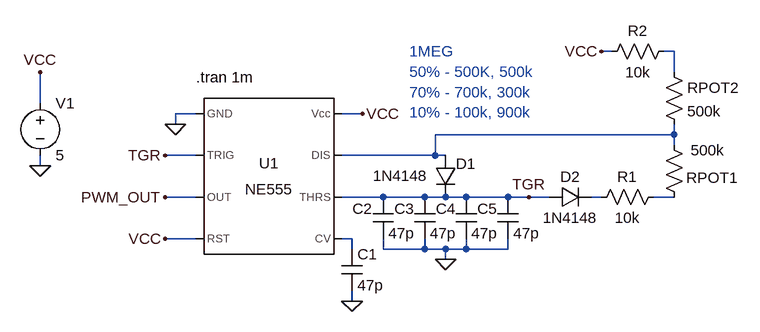
[diagram p0: schematic PWM-gen.asc]
PWM-gen.asc, the LTspice schematic file:
Version 4
SHEET 1 1152 680
WIRE 752 -32 736 -32
WIRE 848 -32 832 -32
WIRE 848 0 848 -32
WIRE -128 48 -128 0
WIRE 112 64 80 64
WIRE 368 64 336 64
WIRE 80 80 80 64
WIRE 848 96 848 80
WIRE 848 96 480 96
WIRE 848 112 848 96
WIRE 112 128 64 128
WIRE 480 128 480 96
WIRE 480 128 336 128
WIRE 496 128 480 128
WIRE -128 144 -128 128
WIRE 112 192 64 192
WIRE 400 192 336 192
WIRE 464 192 400 192
WIRE 496 192 464 192
WIRE 528 192 496 192
WIRE 592 192 528 192
WIRE 624 192 592 192
WIRE 656 192 624 192
WIRE 736 192 720 192
WIRE 848 192 816 192
WIRE 112 256 64 256
WIRE 352 256 336 256
WIRE 352 272 352 256
WIRE 400 272 400 256
WIRE 464 272 464 256
WIRE 464 272 400 272
WIRE 496 272 464 272
WIRE 528 272 528 256
WIRE 528 272 496 272
WIRE 592 272 592 256
WIRE 592 272 528 272
WIRE 496 288 496 272
WIRE 352 352 352 336
FLAG -128 144 0
FLAG -128 0 VCC
FLAG 368 64 VCC
FLAG 64 256 VCC
FLAG 80 80 0
FLAG 64 192 PWM_OUT
FLAG 624 192 TGR
FLAG 64 128 TGR
FLAG 352 352 0
FLAG 736 -32 VCC
FLAG 496 288 0
SYMBOL Misc\\NE555 224 160 R0
SYMATTR InstName U1
SYMBOL voltage -128 32 R0
WINDOW 123 0 0 Left 0
WINDOW 39 0 0 Left 0
SYMATTR InstName V1
SYMATTR Value 5
SYMBOL diode 480 128 R0
WINDOW 0 32 13 Left 2
WINDOW 3 -96 31 Left 2
SYMATTR InstName D1
SYMATTR Value 1N4148
SYMBOL cap 336 272 R0
SYMATTR InstName C1
SYMATTR Value 47p
SYMBOL cap 384 192 R0
WINDOW 0 -31 18 Left 2
SYMATTR InstName C2
SYMATTR Value 47p
SYMBOL res 720 208 R270
WINDOW 0 32 56 VTop 2
WINDOW 3 0 56 VBottom 2
SYMATTR InstName R1
SYMATTR Value 10k
SYMBOL diode 656 208 R270
WINDOW 0 32 32 VTop 2
WINDOW 3 0 32 VBottom 2
SYMATTR InstName D2
SYMATTR Value 1N4148
SYMBOL res 848 -48 R90
WINDOW 0 0 56 VBottom 2
WINDOW 3 32 56 VTop 2
SYMATTR InstName R2
SYMATTR Value 10k
SYMBOL res 864 208 R180
WINDOW 0 -83 46 Left 2
WINDOW 3 -62 88 Left 2
SYMATTR InstName RPOT1
SYMATTR Value 500k
SYMBOL res 832 -16 R0
SYMATTR InstName RPOT2
SYMATTR Value 500k
SYMBOL cap 448 192 R0
WINDOW 0 -31 18 Left 2
SYMATTR InstName C3
SYMATTR Value 47p
SYMBOL cap 512 192 R0
WINDOW 0 -31 18 Left 2
SYMATTR InstName C4
SYMATTR Value 47p
SYMBOL cap 576 192 R0
WINDOW 0 -31 18 Left 2
SYMATTR InstName C5
SYMATTR Value 47p
TEXT 440 -32 Left 2 ;1MEG\n50% - 500K, 500k\n70% - 700k, 300k\n10% - 100k, 900k
TEXT 112 8 Left 2 !.tran 1m

The netlist it stands for:
* PWM-gen.asc
XU1 0 TGR PWM_OUT VCC N005 TGR N002 VCC NE555  ; pins GND TRIG OUT RST CV THRS DIS Vcc
V1 VCC 0 5
D1 N002 TGR 1N4148
C1 N005 0 47p
C2 TGR 0 47p
R1 N003 N004 10k
D2 TGR N003 1N4148
R2 N001 VCC 10k
RPOT1 N004 N002 500k
RPOT2 N001 N002 500k
C3 TGR 0 47p
C4 TGR 0 47p
C5 TGR 0 47p
.model D D
.lib standard.dio
* 1MEG
* 50% - 500K, 500k
* 70% - 700k, 300k
* 10% - 100k, 900k
.tran 1m
.lib NE555.sub
.backanno
.end